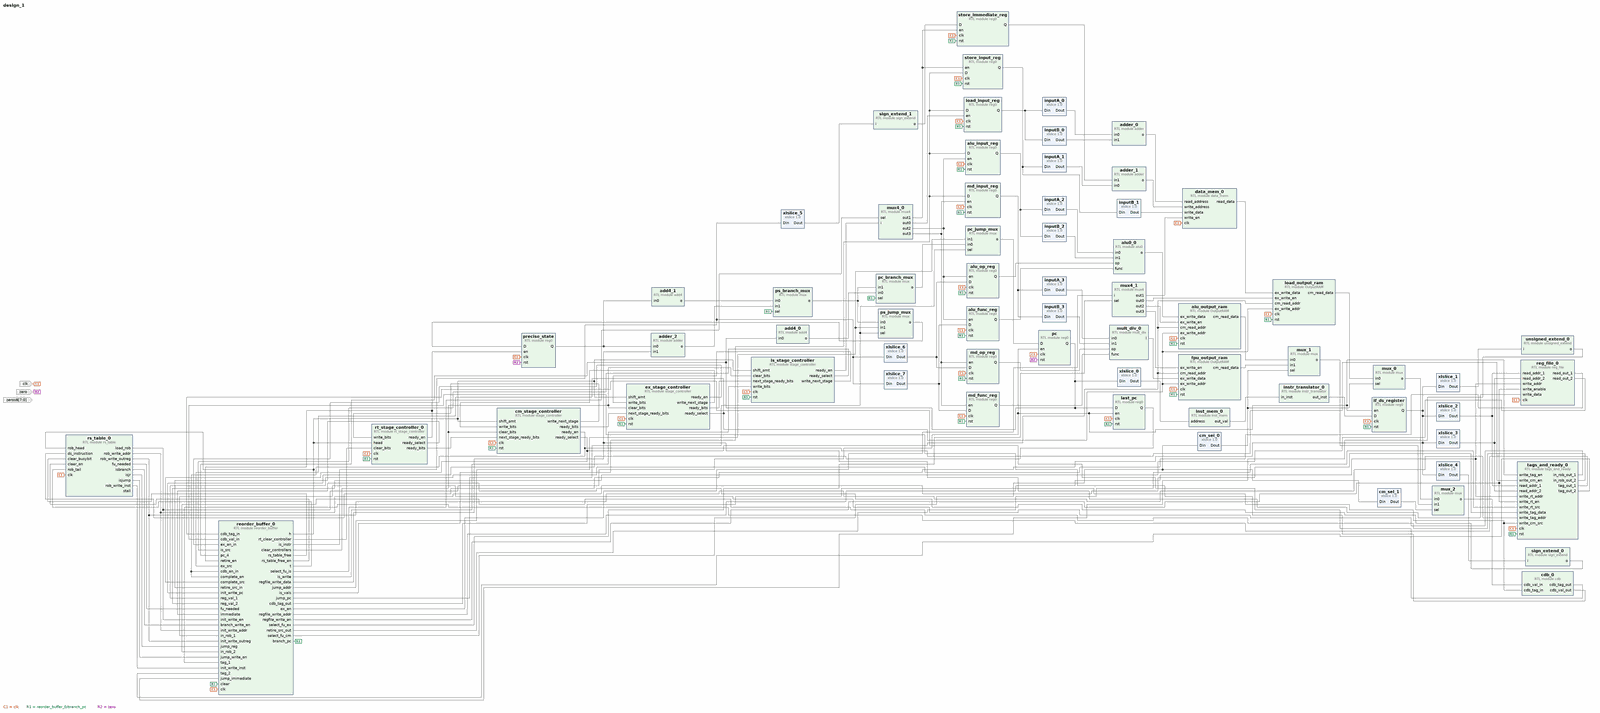
[diagram p0: block diagram of the top level, whole]
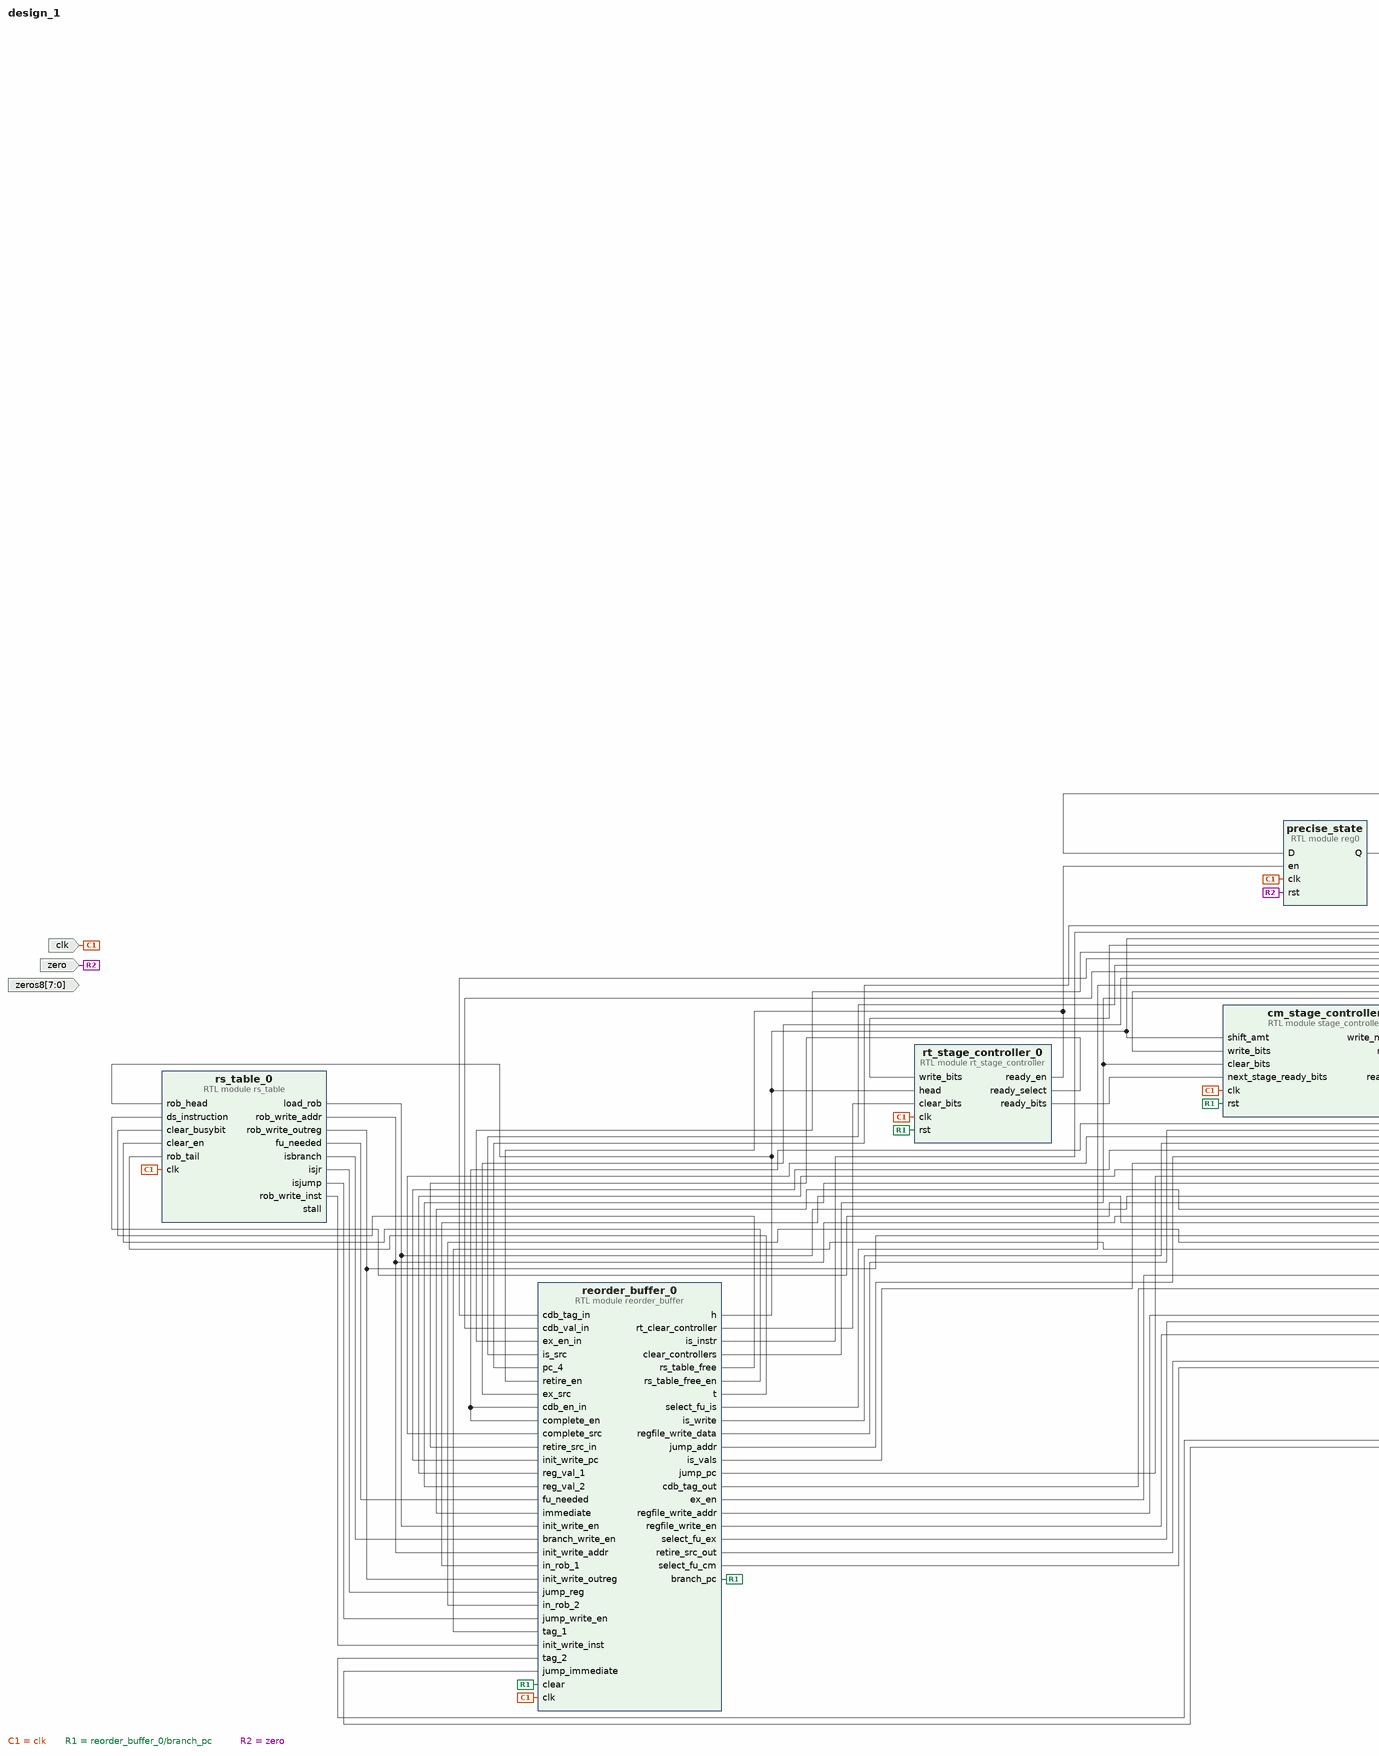
[diagram p1: block diagram of the top level, left part]
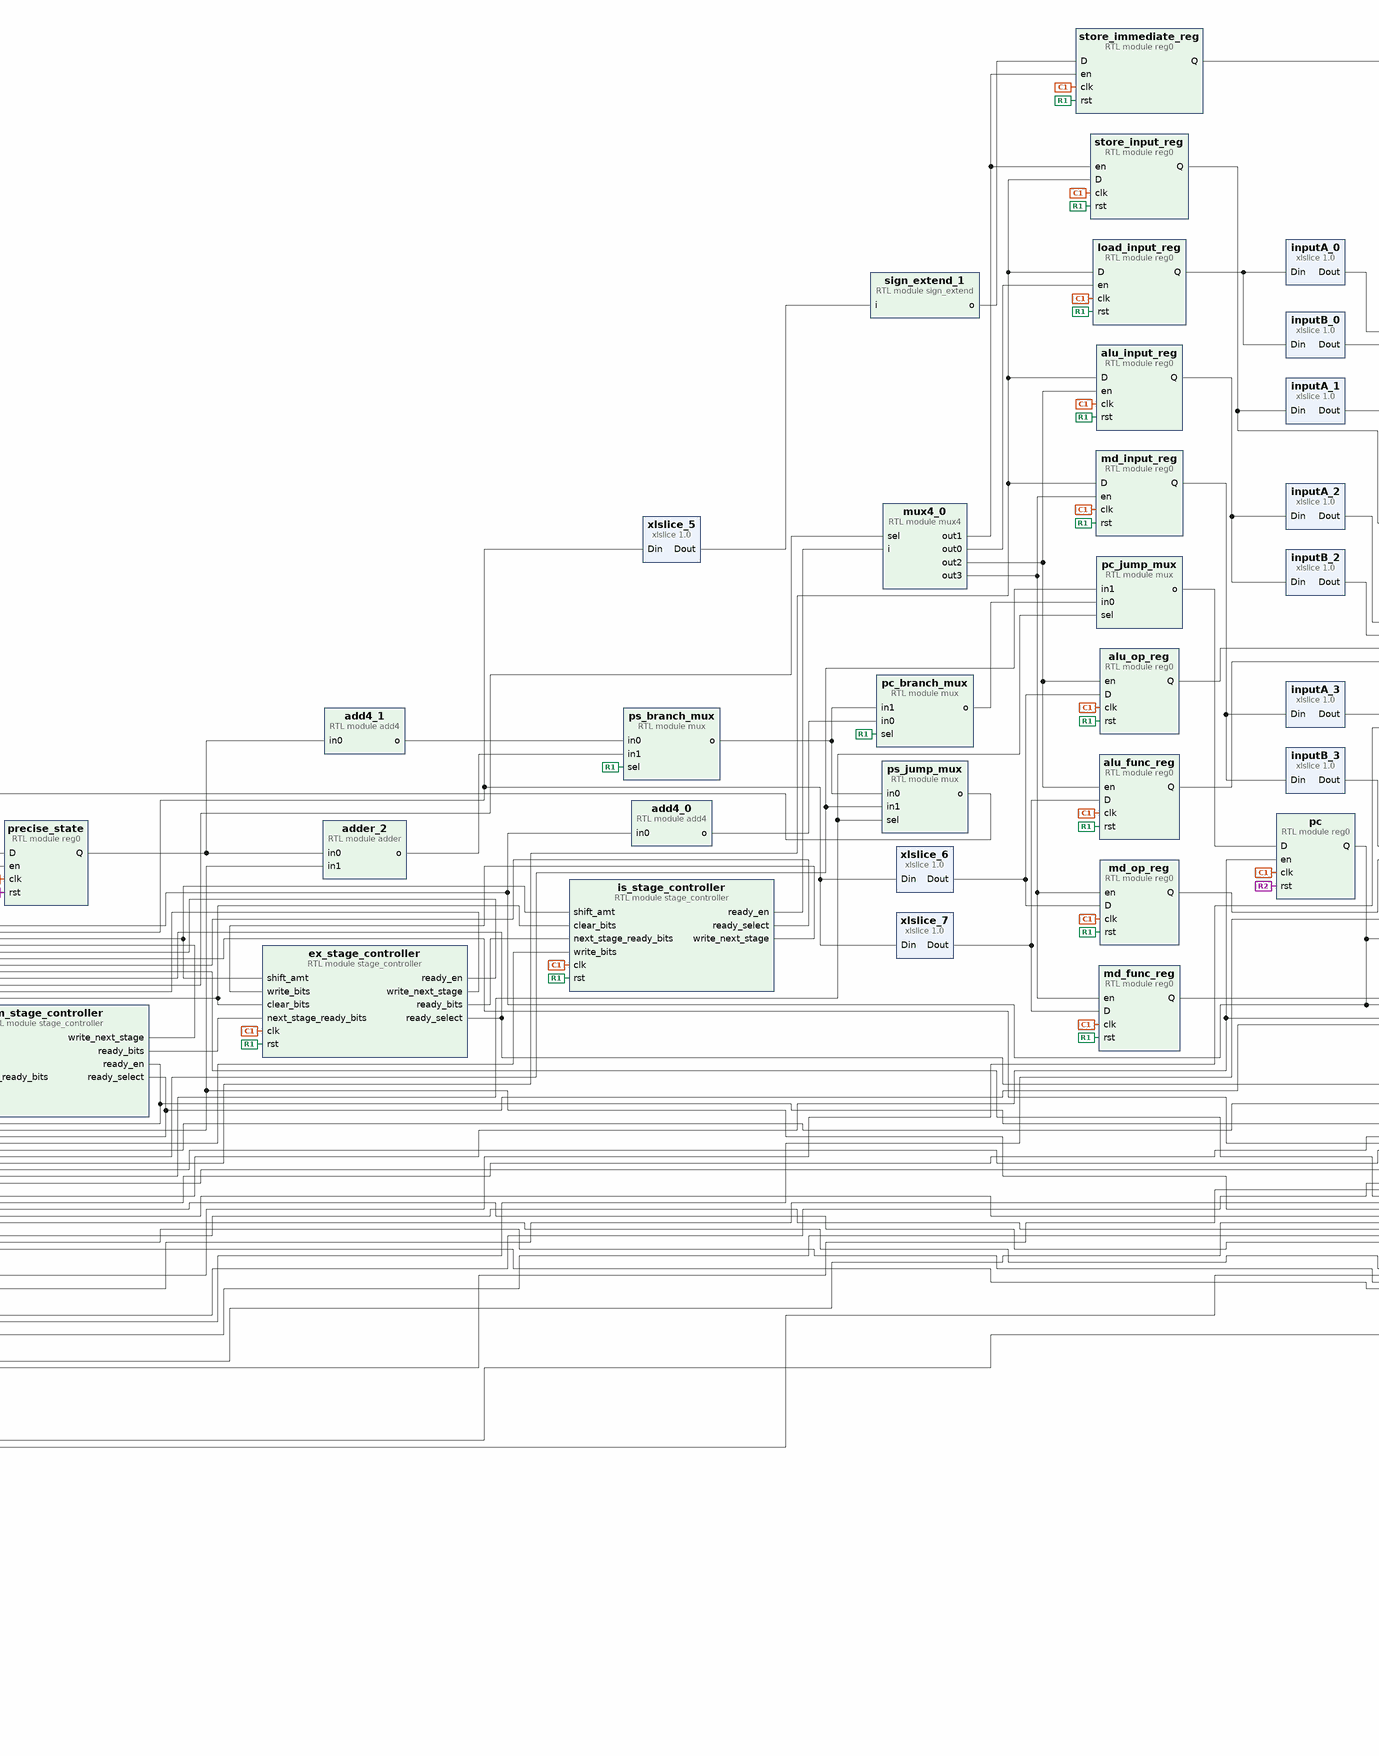
[diagram p2: block diagram of the top level, centre part]
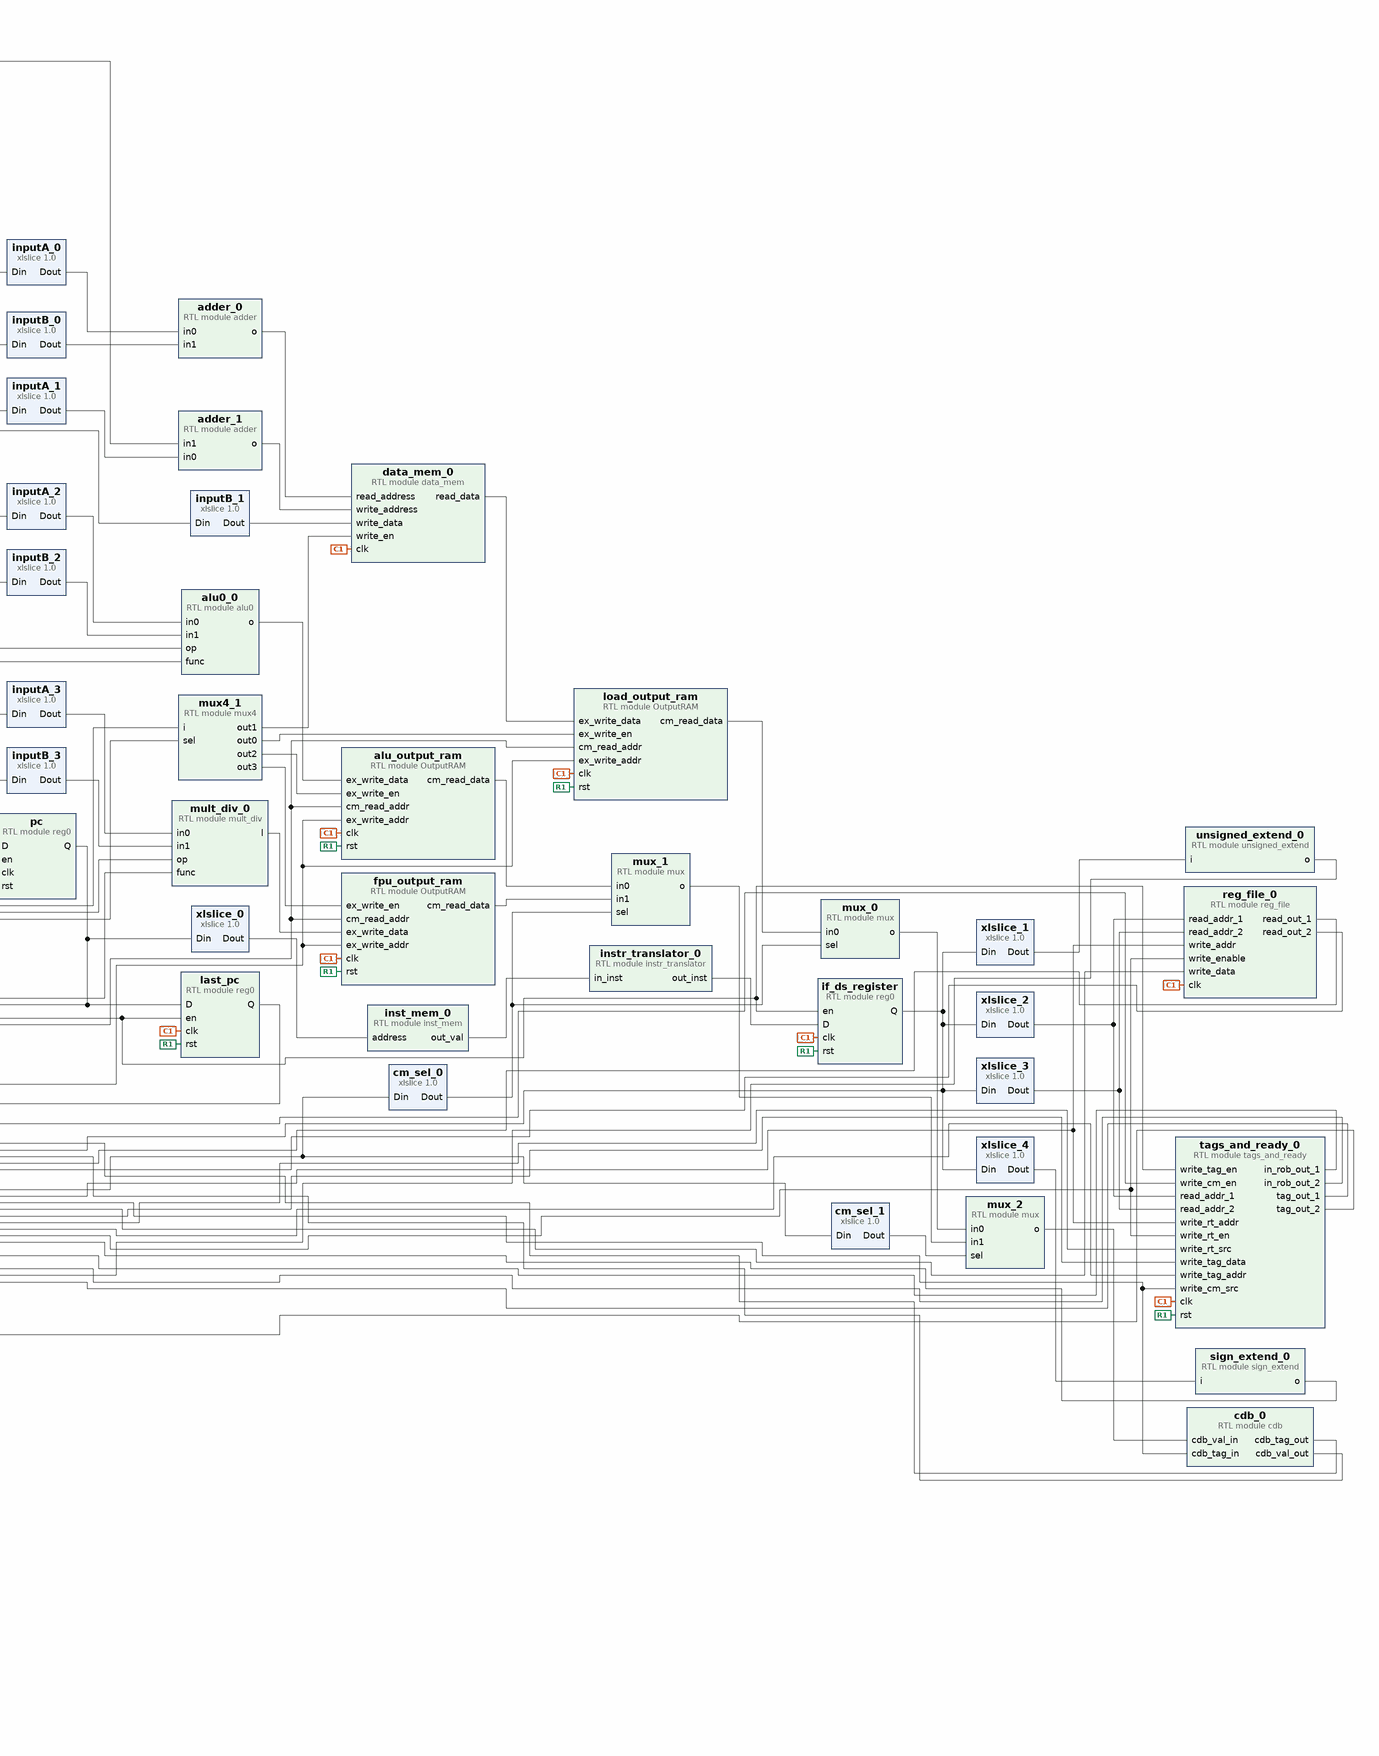
[diagram p3: block diagram of the top level, right part]
# Vivado block design design_1, xc7a35tcpg236-1, Vivado 2023.2
create_bd_design design_1

create_bd_port -dir I clk
create_bd_port -dir I zero
create_bd_port -dir I -from 7 -to 0 zeros8

create_bd_cell -type module -reference inst_mem inst_mem_0
create_bd_cell -type ip -vlnv xilinx.com:ip:xlslice:1.0 xlslice_0
set_property -dict {CONFIG.DIN_TO 0 CONFIG.DOUT_WIDTH 10} [get_bd_cells xlslice_0]
create_bd_cell -type module -reference reg_file reg_file_0
create_bd_cell -type ip -vlnv xilinx.com:ip:xlslice:1.0 xlslice_2
set_property -dict {CONFIG.DIN_FROM 25 CONFIG.DIN_TO 21} [get_bd_cells xlslice_2]
create_bd_cell -type ip -vlnv xilinx.com:ip:xlslice:1.0 xlslice_3
set_property -dict {CONFIG.DIN_FROM 20 CONFIG.DIN_TO 16} [get_bd_cells xlslice_3]
create_bd_cell -type module -reference sign_extend sign_extend_0
create_bd_cell -type ip -vlnv xilinx.com:ip:xlslice:1.0 xlslice_4
set_property -dict {CONFIG.DIN_FROM 15} [get_bd_cells xlslice_4]
create_bd_cell -type module -reference tags_and_ready tags_and_ready_0
create_bd_cell -type module -reference reorder_buffer reorder_buffer_0
create_bd_cell -type module -reference rs_table rs_table_0
create_bd_cell -type ip -vlnv xilinx.com:ip:xlslice:1.0 inputA_0
set_property -dict {CONFIG.DIN_FROM 63 CONFIG.DIN_TO 32 CONFIG.DIN_WIDTH 64} [get_bd_cells inputA_0]
create_bd_cell -type ip -vlnv xilinx.com:ip:xlslice:1.0 inputB_0
set_property -dict {CONFIG.DIN_FROM 31 CONFIG.DIN_TO 0 CONFIG.DIN_WIDTH 64} [get_bd_cells inputB_0]
create_bd_cell -type ip -vlnv xilinx.com:ip:xlslice:1.0 inputA_1
set_property -dict {CONFIG.DIN_FROM 63 CONFIG.DIN_TO 32 CONFIG.DIN_WIDTH 64} [get_bd_cells inputA_1]
create_bd_cell -type ip -vlnv xilinx.com:ip:xlslice:1.0 inputA_2
set_property -dict {CONFIG.DIN_FROM 63 CONFIG.DIN_TO 32 CONFIG.DIN_WIDTH 64} [get_bd_cells inputA_2]
create_bd_cell -type ip -vlnv xilinx.com:ip:xlslice:1.0 inputA_3
set_property -dict {CONFIG.DIN_FROM 63 CONFIG.DIN_TO 32 CONFIG.DIN_WIDTH 64} [get_bd_cells inputA_3]
create_bd_cell -type ip -vlnv xilinx.com:ip:xlslice:1.0 inputB_1
set_property -dict {CONFIG.DIN_FROM 31 CONFIG.DIN_TO 0 CONFIG.DIN_WIDTH 64} [get_bd_cells inputB_1]
create_bd_cell -type ip -vlnv xilinx.com:ip:xlslice:1.0 inputB_2
set_property -dict {CONFIG.DIN_FROM 31 CONFIG.DIN_TO 0 CONFIG.DIN_WIDTH 64} [get_bd_cells inputB_2]
create_bd_cell -type ip -vlnv xilinx.com:ip:xlslice:1.0 inputB_3
set_property -dict {CONFIG.DIN_FROM 31 CONFIG.DIN_TO 0 CONFIG.DIN_WIDTH 64} [get_bd_cells inputB_3]
create_bd_cell -type module -reference mux4 mux4_0
set_property -dict {CONFIG.width 1} [get_bd_cells mux4_0]
create_bd_cell -type module -reference mux4 mux4_1
set_property -dict {CONFIG.width 1} [get_bd_cells mux4_1]
create_bd_cell -type module -reference data_mem data_mem_0
create_bd_cell -type module -reference adder adder_0
create_bd_cell -type module -reference adder adder_1
create_bd_cell -type ip -vlnv xilinx.com:ip:xlslice:1.0 xlslice_5
set_property -dict {CONFIG.DIN_FROM 15} [get_bd_cells xlslice_5]
create_bd_cell -type module -reference sign_extend sign_extend_1
create_bd_cell -type module -reference alu0 alu0_0
create_bd_cell -type ip -vlnv xilinx.com:ip:xlslice:1.0 xlslice_6
set_property -dict {CONFIG.DIN_FROM 31 CONFIG.DIN_TO 26} [get_bd_cells xlslice_6]
create_bd_cell -type ip -vlnv xilinx.com:ip:xlslice:1.0 xlslice_7
set_property -dict {CONFIG.DIN_FROM 5} [get_bd_cells xlslice_7]
create_bd_cell -type module -reference instr_translator instr_translator_0
create_bd_cell -type module -reference mult_div mult_div_0
create_bd_cell -type module -reference cdb cdb_0
create_bd_cell -type module -reference mux mux_0
create_bd_cell -type module -reference mux mux_1
create_bd_cell -type module -reference mux mux_2
create_bd_cell -type ip -vlnv xilinx.com:ip:xlslice:1.0 cm_sel_1
set_property -dict {CONFIG.DIN_FROM 1 CONFIG.DIN_TO 1 CONFIG.DIN_WIDTH 2} [get_bd_cells cm_sel_1]
create_bd_cell -type ip -vlnv xilinx.com:ip:xlslice:1.0 cm_sel_0
set_property -dict {CONFIG.DIN_FROM 0 CONFIG.DIN_TO 0 CONFIG.DIN_WIDTH 2} [get_bd_cells cm_sel_0]
create_bd_cell -type module -reference add4 add4_0
create_bd_cell -type module -reference reg0 pc
create_bd_cell -type module -reference reg0 if_ds_register
create_bd_cell -type module -reference reg0 load_input_reg
set_property -dict {CONFIG.size 64} [get_bd_cells load_input_reg]
create_bd_cell -type module -reference reg0 store_input_reg
set_property -dict {CONFIG.size 64} [get_bd_cells store_input_reg]
create_bd_cell -type module -reference reg0 store_immediate_reg
set_property -dict {CONFIG.size 32} [get_bd_cells store_immediate_reg]
create_bd_cell -type module -reference reg0 alu_input_reg
set_property -dict {CONFIG.size 64} [get_bd_cells alu_input_reg]
create_bd_cell -type module -reference reg0 alu_op_reg
set_property -dict {CONFIG.size 6} [get_bd_cells alu_op_reg]
create_bd_cell -type module -reference reg0 alu_func_reg
set_property -dict {CONFIG.size 6} [get_bd_cells alu_func_reg]
create_bd_cell -type module -reference reg0 md_input_reg
set_property -dict {CONFIG.size 64} [get_bd_cells md_input_reg]
create_bd_cell -type module -reference reg0 md_op_reg
set_property -dict {CONFIG.size 6} [get_bd_cells md_op_reg]
create_bd_cell -type module -reference reg0 md_func_reg
set_property -dict {CONFIG.size 6} [get_bd_cells md_func_reg]
create_bd_cell -type module -reference stage_controller is_stage_controller
create_bd_cell -type module -reference stage_controller ex_stage_controller
create_bd_cell -type module -reference stage_controller cm_stage_controller
create_bd_cell -type module -reference OutputRAM load_output_ram
create_bd_cell -type module -reference OutputRAM alu_output_ram
create_bd_cell -type module -reference OutputRAM fpu_output_ram
create_bd_cell -type module -reference reg0 last_pc
create_bd_cell -type module -reference rt_stage_controller rt_stage_controller_0
create_bd_cell -type module -reference reg0 precise_state
create_bd_cell -type module -reference add4 add4_1
create_bd_cell -type module -reference adder adder_2
create_bd_cell -type module -reference mux ps_branch_mux
create_bd_cell -type module -reference mux pc_branch_mux
create_bd_cell -type ip -vlnv xilinx.com:ip:xlslice:1.0 xlslice_1
set_property -dict {CONFIG.DIN_FROM 25} [get_bd_cells xlslice_1]
create_bd_cell -type module -reference unsigned_extend unsigned_extend_0
create_bd_cell -type module -reference mux ps_jump_mux
create_bd_cell -type module -reference mux pc_jump_mux

# ---- connections ----

connect_bd_net [get_bd_pins reorder_buffer_0/is_write] [get_bd_pins is_stage_controller/write_bits]
connect_bd_net [get_bd_pins add4_0/o] [get_bd_pins pc_branch_mux/in0]
connect_bd_net [get_bd_pins add4_1/o] [get_bd_pins ps_branch_mux/in0]
connect_bd_net [get_bd_pins adder_0/o] [get_bd_pins data_mem_0/read_address]
connect_bd_net [get_bd_pins adder_1/o] [get_bd_pins data_mem_0/write_address]
connect_bd_net [get_bd_pins adder_2/o] [get_bd_pins ps_branch_mux/in1]
connect_bd_net [get_bd_pins alu0_0/o] [get_bd_pins alu_output_ram/ex_write_data]
connect_bd_net [get_bd_pins alu_func_reg/Q] [get_bd_pins alu0_0/func]
connect_bd_net [get_bd_pins alu_input_reg/Q] [get_bd_pins inputA_2/Din] [get_bd_pins inputB_2/Din]
connect_bd_net [get_bd_pins alu_op_reg/Q] [get_bd_pins alu0_0/op]
connect_bd_net [get_bd_pins alu_output_ram/cm_read_data] [get_bd_pins mux_1/in0]
connect_bd_net [get_bd_pins cdb_0/cdb_tag_out] [get_bd_pins reorder_buffer_0/cdb_tag_in]
connect_bd_net [get_bd_pins cdb_0/cdb_val_out] [get_bd_pins reorder_buffer_0/cdb_val_in]
connect_bd_net [get_bd_ports clk] \
  [get_bd_pins reg_file_0/clk] [get_bd_pins pc/clk] [get_bd_pins if_ds_register/clk] [get_bd_pins md_func_reg/clk] \
  [get_bd_pins load_input_reg/clk] [get_bd_pins store_input_reg/clk] [get_bd_pins store_immediate_reg/clk] \
  [get_bd_pins alu_input_reg/clk] [get_bd_pins alu_op_reg/clk] [get_bd_pins alu_func_reg/clk] [get_bd_pins md_input_reg/clk] \
  [get_bd_pins md_op_reg/clk] [get_bd_pins data_mem_0/clk] [get_bd_pins load_output_ram/clk] [get_bd_pins alu_output_ram/clk] \
  [get_bd_pins fpu_output_ram/clk] [get_bd_pins last_pc/clk] [get_bd_pins precise_state/clk] \
  [get_bd_pins is_stage_controller/clk] [get_bd_pins ex_stage_controller/clk] [get_bd_pins cm_stage_controller/clk] \
  [get_bd_pins rt_stage_controller_0/clk] [get_bd_pins tags_and_ready_0/clk] [get_bd_pins rs_table_0/clk] \
  [get_bd_pins reorder_buffer_0/clk]
connect_bd_net [get_bd_pins cm_sel_0/Dout] [get_bd_pins mux_0/sel] [get_bd_pins mux_1/sel]
connect_bd_net [get_bd_pins cm_sel_1/Dout] [get_bd_pins mux_2/sel]
connect_bd_net [get_bd_pins cm_stage_controller/ready_bits] [get_bd_pins ex_stage_controller/next_stage_ready_bits]
connect_bd_net [get_bd_pins cm_stage_controller/ready_en] \
  [get_bd_pins tags_and_ready_0/write_cm_en] [get_bd_pins reorder_buffer_0/complete_en] \
  [get_bd_pins reorder_buffer_0/cdb_en_in]
connect_bd_net [get_bd_pins cm_stage_controller/ready_select] \
  [get_bd_pins load_output_ram/cm_read_addr] [get_bd_pins alu_output_ram/cm_read_addr] \
  [get_bd_pins fpu_output_ram/cm_read_addr] [get_bd_pins reorder_buffer_0/complete_src]
connect_bd_net [get_bd_pins cm_stage_controller/write_next_stage] [get_bd_pins rt_stage_controller_0/write_bits]
connect_bd_net [get_bd_pins data_mem_0/read_data] [get_bd_pins load_output_ram/ex_write_data]
connect_bd_net [get_bd_pins ex_stage_controller/ready_bits] [get_bd_pins is_stage_controller/next_stage_ready_bits]
connect_bd_net [get_bd_pins ex_stage_controller/ready_en] [get_bd_pins reorder_buffer_0/ex_en_in]
connect_bd_net [get_bd_pins ex_stage_controller/ready_select] \
  [get_bd_pins load_output_ram/ex_write_addr] [get_bd_pins alu_output_ram/ex_write_addr] \
  [get_bd_pins fpu_output_ram/ex_write_addr] [get_bd_pins reorder_buffer_0/ex_src]
connect_bd_net [get_bd_pins ex_stage_controller/write_next_stage] [get_bd_pins cm_stage_controller/write_bits]
connect_bd_net [get_bd_pins fpu_output_ram/cm_read_data] [get_bd_pins mux_1/in1]
connect_bd_net [get_bd_pins inputA_0/Dout] [get_bd_pins adder_0/in0]
connect_bd_net [get_bd_pins inputA_1/Dout] [get_bd_pins adder_1/in0]
connect_bd_net [get_bd_pins inputA_2/Dout] [get_bd_pins alu0_0/in0]
connect_bd_net [get_bd_pins inputA_3/Dout] [get_bd_pins mult_div_0/in0]
connect_bd_net [get_bd_pins inputB_0/Dout] [get_bd_pins adder_0/in1]
connect_bd_net [get_bd_pins inputB_1/Dout] [get_bd_pins data_mem_0/write_data]
connect_bd_net [get_bd_pins inputB_2/Dout] [get_bd_pins alu0_0/in1]
connect_bd_net [get_bd_pins inputB_3/Dout] [get_bd_pins mult_div_0/in1]
connect_bd_net [get_bd_pins inst_mem_0/out_val] [get_bd_pins instr_translator_0/in_inst]
connect_bd_net [get_bd_pins instr_translator_0/out_inst] [get_bd_pins if_ds_register/D]
connect_bd_net [get_bd_pins is_stage_controller/ready_select] [get_bd_pins reorder_buffer_0/is_src]
connect_bd_net [get_bd_pins is_stage_controller/write_next_stage] [get_bd_pins ex_stage_controller/write_bits]
connect_bd_net [get_bd_pins last_pc/Q] [get_bd_pins reorder_buffer_0/init_write_pc]
connect_bd_net [get_bd_pins load_input_reg/Q] [get_bd_pins inputA_0/Din] [get_bd_pins inputB_0/Din]
connect_bd_net [get_bd_pins load_output_ram/cm_read_data] [get_bd_pins mux_0/in0]
connect_bd_net [get_bd_pins md_func_reg/Q] [get_bd_pins mult_div_0/func]
connect_bd_net [get_bd_pins md_input_reg/Q] [get_bd_pins inputB_3/Din] [get_bd_pins inputA_3/Din]
connect_bd_net [get_bd_pins md_op_reg/Q] [get_bd_pins mult_div_0/op]
connect_bd_net [get_bd_pins mult_div_0/l] [get_bd_pins fpu_output_ram/ex_write_data]
connect_bd_net [get_bd_pins mux4_0/out0] [get_bd_pins load_input_reg/en]
connect_bd_net [get_bd_pins mux4_0/out1] [get_bd_pins store_input_reg/en] [get_bd_pins store_immediate_reg/en]
connect_bd_net [get_bd_pins mux4_0/out2] [get_bd_pins alu_input_reg/en] [get_bd_pins alu_op_reg/en] [get_bd_pins alu_func_reg/en]
connect_bd_net [get_bd_pins mux4_0/out3] [get_bd_pins md_func_reg/en] [get_bd_pins md_input_reg/en] [get_bd_pins md_op_reg/en]
connect_bd_net [get_bd_pins mux4_1/out0] [get_bd_pins load_output_ram/ex_write_en]
connect_bd_net [get_bd_pins mux4_1/out1] [get_bd_pins data_mem_0/write_en]
connect_bd_net [get_bd_pins mux4_1/out2] [get_bd_pins alu_output_ram/ex_write_en]
connect_bd_net [get_bd_pins mux4_1/out3] [get_bd_pins fpu_output_ram/ex_write_en]
connect_bd_net [get_bd_pins mux_0/o] [get_bd_pins mux_2/in0]
connect_bd_net [get_bd_pins mux_1/o] [get_bd_pins mux_2/in1]
connect_bd_net [get_bd_pins mux_2/o] [get_bd_pins cdb_0/cdb_val_in]
connect_bd_net -net mux_3_o [get_bd_pins ps_branch_mux/o] [get_bd_pins pc_branch_mux/in1] [get_bd_pins ps_jump_mux/in0]
connect_bd_net [get_bd_pins pc_branch_mux/o] [get_bd_pins pc_jump_mux/in0]
connect_bd_net [get_bd_pins pc_jump_mux/o] [get_bd_pins pc/D]
connect_bd_net [get_bd_pins precise_state/Q] [get_bd_pins add4_1/in0] [get_bd_pins adder_2/in0]
connect_bd_net [get_bd_pins ps_jump_mux/o] [get_bd_pins precise_state/D]
connect_bd_net -net reg_0_Q [get_bd_pins pc/Q] \
  [get_bd_pins xlslice_0/Din] [get_bd_pins add4_0/in0] [get_bd_pins last_pc/D] [get_bd_pins reorder_buffer_0/pc_4]
connect_bd_net -net reg_1_Q [get_bd_pins if_ds_register/Q] \
  [get_bd_pins xlslice_2/Din] [get_bd_pins xlslice_3/Din] [get_bd_pins xlslice_4/Din] [get_bd_pins xlslice_1/Din] \
  [get_bd_pins rs_table_0/ds_instruction]
connect_bd_net [get_bd_pins reg_file_0/read_out_1] [get_bd_pins reorder_buffer_0/reg_val_1]
connect_bd_net [get_bd_pins reg_file_0/read_out_2] [get_bd_pins reorder_buffer_0/reg_val_2]
connect_bd_net [get_bd_pins reorder_buffer_0/branch_pc] \
  [get_bd_pins ps_branch_mux/sel] [get_bd_pins pc_branch_mux/sel] [get_bd_pins if_ds_register/rst] [get_bd_pins last_pc/rst] \
  [get_bd_pins tags_and_ready_0/rst] [get_bd_pins load_input_reg/rst] [get_bd_pins store_input_reg/rst] \
  [get_bd_pins store_immediate_reg/rst] [get_bd_pins alu_input_reg/rst] [get_bd_pins alu_func_reg/rst] \
  [get_bd_pins alu_op_reg/rst] [get_bd_pins md_input_reg/rst] [get_bd_pins md_op_reg/rst] [get_bd_pins md_func_reg/rst] \
  [get_bd_pins load_output_ram/rst] [get_bd_pins alu_output_ram/rst] [get_bd_pins fpu_output_ram/rst] \
  [get_bd_pins rt_stage_controller_0/rst] [get_bd_pins cm_stage_controller/rst] [get_bd_pins ex_stage_controller/rst] \
  [get_bd_pins is_stage_controller/rst] [get_bd_pins reorder_buffer_0/clear]
connect_bd_net [get_bd_pins reorder_buffer_0/cdb_tag_out] [get_bd_pins cdb_0/cdb_tag_in] [get_bd_pins tags_and_ready_0/write_cm_src]
connect_bd_net [get_bd_pins reorder_buffer_0/clear_controllers] \
  [get_bd_pins is_stage_controller/clear_bits] [get_bd_pins ex_stage_controller/clear_bits] \
  [get_bd_pins cm_stage_controller/clear_bits]
connect_bd_net [get_bd_pins reorder_buffer_0/ex_en] [get_bd_pins mux4_1/i]
connect_bd_net [get_bd_pins reorder_buffer_0/h] \
  [get_bd_pins is_stage_controller/shift_amt] [get_bd_pins ex_stage_controller/shift_amt] \
  [get_bd_pins cm_stage_controller/shift_amt] [get_bd_pins rt_stage_controller_0/head] [get_bd_pins rs_table_0/rob_head]
connect_bd_net -net reorder_buffer_0_is_en [get_bd_pins is_stage_controller/ready_en] [get_bd_pins mux4_0/i]
connect_bd_net [get_bd_pins reorder_buffer_0/is_instr] [get_bd_pins xlslice_5/Din] [get_bd_pins xlslice_6/Din] [get_bd_pins xlslice_7/Din]
connect_bd_net [get_bd_pins reorder_buffer_0/is_vals] \
  [get_bd_pins load_input_reg/D] [get_bd_pins store_input_reg/D] [get_bd_pins alu_input_reg/D] [get_bd_pins md_input_reg/D]
connect_bd_net [get_bd_pins reorder_buffer_0/jump_addr] [get_bd_pins ps_jump_mux/in1] [get_bd_pins pc_jump_mux/in1]
connect_bd_net [get_bd_pins reorder_buffer_0/jump_pc] [get_bd_pins pc_jump_mux/sel] [get_bd_pins ps_jump_mux/sel]
connect_bd_net [get_bd_pins reorder_buffer_0/regfile_write_addr] [get_bd_pins reg_file_0/write_addr] [get_bd_pins tags_and_ready_0/write_rt_addr]
connect_bd_net [get_bd_pins reorder_buffer_0/regfile_write_data] [get_bd_pins reg_file_0/write_data] [get_bd_pins adder_2/in1]
connect_bd_net [get_bd_pins reorder_buffer_0/regfile_write_en] [get_bd_pins reg_file_0/write_enable] [get_bd_pins tags_and_ready_0/write_rt_en]
connect_bd_net -net reorder_buffer_0_retire_src [get_bd_pins reorder_buffer_0/retire_src_out] [get_bd_pins tags_and_ready_0/write_rt_src]
connect_bd_net [get_bd_pins reorder_buffer_0/rs_table_free] [get_bd_pins rs_table_0/clear_busybit]
connect_bd_net [get_bd_pins reorder_buffer_0/rs_table_free_en] [get_bd_pins rs_table_0/clear_en]
connect_bd_net [get_bd_pins reorder_buffer_0/rt_clear_controller] [get_bd_pins rt_stage_controller_0/clear_bits]
connect_bd_net [get_bd_pins reorder_buffer_0/select_fu_cm] [get_bd_pins cm_sel_1/Din] [get_bd_pins cm_sel_0/Din]
connect_bd_net [get_bd_pins reorder_buffer_0/select_fu_ex] [get_bd_pins mux4_1/sel]
connect_bd_net [get_bd_pins reorder_buffer_0/select_fu_is] [get_bd_pins mux4_0/sel]
connect_bd_net [get_bd_pins reorder_buffer_0/t] [get_bd_pins rs_table_0/rob_tail]
connect_bd_net [get_bd_pins rs_table_0/fu_needed] [get_bd_pins reorder_buffer_0/fu_needed]
connect_bd_net [get_bd_pins rs_table_0/isbranch] [get_bd_pins reorder_buffer_0/branch_write_en]
connect_bd_net [get_bd_pins rs_table_0/isjr] [get_bd_pins reorder_buffer_0/jump_reg]
connect_bd_net [get_bd_pins rs_table_0/isjump] [get_bd_pins reorder_buffer_0/jump_write_en]
connect_bd_net [get_bd_pins rs_table_0/load_rob] \
  [get_bd_pins if_ds_register/en] [get_bd_pins pc/en] [get_bd_pins last_pc/en] [get_bd_pins tags_and_ready_0/write_tag_en] \
  [get_bd_pins reorder_buffer_0/init_write_en]
connect_bd_net [get_bd_pins rs_table_0/rob_write_addr] [get_bd_pins tags_and_ready_0/write_tag_data] [get_bd_pins reorder_buffer_0/init_write_addr]
connect_bd_net [get_bd_pins rs_table_0/rob_write_inst] [get_bd_pins reorder_buffer_0/init_write_inst]
connect_bd_net [get_bd_pins rs_table_0/rob_write_outreg] \
  [get_bd_pins tags_and_ready_0/write_tag_addr] [get_bd_pins reorder_buffer_0/init_write_outreg]
# net rs_table_0_stall has one end: rs_table_0/stall
connect_bd_net [get_bd_pins rt_stage_controller_0/ready_bits] [get_bd_pins cm_stage_controller/next_stage_ready_bits]
connect_bd_net [get_bd_pins rt_stage_controller_0/ready_en] [get_bd_pins precise_state/en] [get_bd_pins reorder_buffer_0/retire_en]
connect_bd_net [get_bd_pins rt_stage_controller_0/ready_select] [get_bd_pins reorder_buffer_0/retire_src_in]
connect_bd_net [get_bd_pins sign_extend_0/o] [get_bd_pins reorder_buffer_0/immediate]
connect_bd_net [get_bd_pins sign_extend_1/o] [get_bd_pins store_immediate_reg/D]
connect_bd_net [get_bd_pins store_immediate_reg/Q] [get_bd_pins adder_1/in1]
connect_bd_net [get_bd_pins store_input_reg/Q] [get_bd_pins inputA_1/Din] [get_bd_pins inputB_1/Din]
connect_bd_net [get_bd_pins tags_and_ready_0/in_rob_out_1] [get_bd_pins reorder_buffer_0/in_rob_1]
connect_bd_net [get_bd_pins tags_and_ready_0/in_rob_out_2] [get_bd_pins reorder_buffer_0/in_rob_2]
connect_bd_net [get_bd_pins tags_and_ready_0/tag_out_1] [get_bd_pins reorder_buffer_0/tag_1]
connect_bd_net [get_bd_pins tags_and_ready_0/tag_out_2] [get_bd_pins reorder_buffer_0/tag_2]
connect_bd_net [get_bd_pins unsigned_extend_0/o] [get_bd_pins reorder_buffer_0/jump_immediate]
connect_bd_net [get_bd_pins xlslice_0/Dout] [get_bd_pins inst_mem_0/address]
connect_bd_net [get_bd_pins xlslice_1/Dout] [get_bd_pins unsigned_extend_0/i]
connect_bd_net [get_bd_pins xlslice_2/Dout] [get_bd_pins reg_file_0/read_addr_1] [get_bd_pins tags_and_ready_0/read_addr_1]
connect_bd_net [get_bd_pins xlslice_3/Dout] [get_bd_pins reg_file_0/read_addr_2] [get_bd_pins tags_and_ready_0/read_addr_2]
connect_bd_net [get_bd_pins xlslice_4/Dout] [get_bd_pins sign_extend_0/i]
connect_bd_net [get_bd_pins xlslice_5/Dout] [get_bd_pins sign_extend_1/i]
connect_bd_net [get_bd_pins xlslice_6/Dout] [get_bd_pins alu_op_reg/D] [get_bd_pins md_op_reg/D]
connect_bd_net [get_bd_pins xlslice_7/Dout] [get_bd_pins md_func_reg/D] [get_bd_pins alu_func_reg/D]
connect_bd_net [get_bd_ports zero] [get_bd_pins pc/rst] [get_bd_pins precise_state/rst]

set_property USER_COMMENTS.comment_1 {Counter here for mul/div, Or outputs to controllers. use the enable to is stage registers
another register for which rob spot is calling. mauybe also like an "in progres" register} [current_bd_design]
set_property USER_COMMENTS.comment_2 {counter for mul/div. use is stage register enable for enable for this. 
also have in progress/busy register. also register for which rob location is clalling this. 
or outputs at end for ready.} [current_bd_design]

validate_bd_design
save_bd_design
